# Altium schematic sheet Sheet1.SchDoc
size A
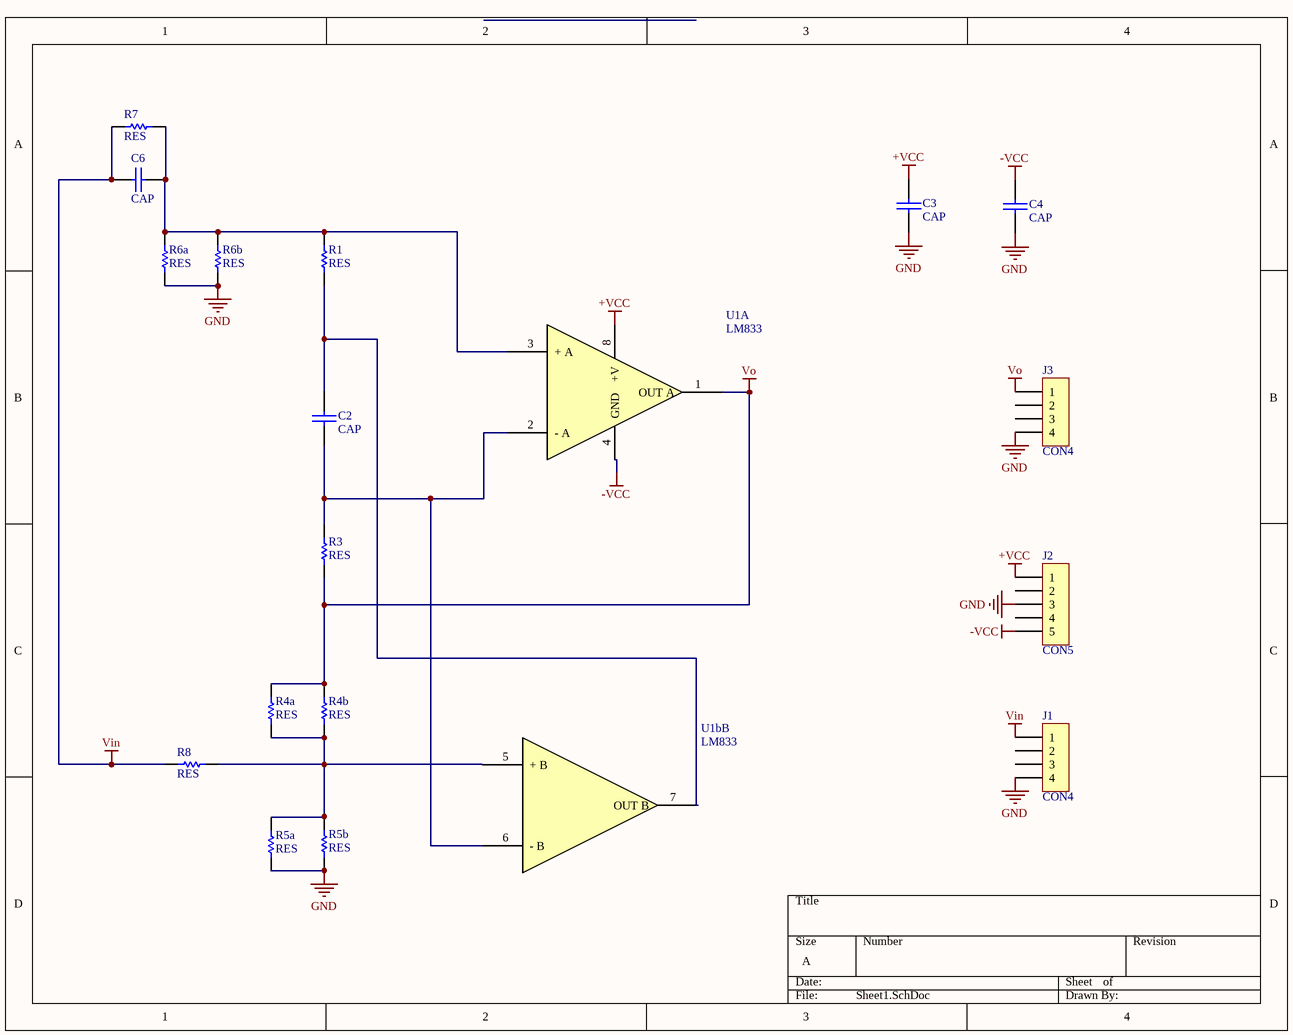
[diagram p0: Sheet1.SchDoc]

## Parts
C2  CAP  [CAP200]
C3  CAP  [CAP200]
C4  CAP  [CAP200]
C6  CAP  [CAP200]
J1  CON4  [SIP4]
J2  CON5  [SIP5]
J3  CON4  [SIP4]
R1  RES  [0805]
R3  RES  [0805]
R4a  RES  [0805]
R4b  RES  [0805]
R5a  RES  [0805]
R5b  RES  [0805]
R6a  RES  [0805]
R6b  RES  [0805]
R7  RES  [0805]
R8  RES  [0805]
U1  LM833  [DIP8]  (part A of 2)
U1b  LM833  [DIP8]  (part B of 2)

## Nets
+VCC: C3.1 J2.1 U1.8(+V)
-VCC: C4.1 J2.5 U1.4(GND)
GND: C3.2 C4.2 J1.4 J2.3 J3.4 R5a.1 R5b.1 R6a.1 R6b.1
Vin: C6.1 J1.1 R7.1 R8.1
Vo: J3.1 R3.1 R4a.2 R4b.2 U1.1(OUT_A)
NetC2_1: C2.1 R1.1 U1b.7(OUT_B)
NetC2_2: C2.2 R3.2 U1.2(-_A) U1b.6(-_B)
NetC6_2: C6.2 R1.2 R6a.2 R6b.2 R7.2 U1.3(+_A)
NetR4a_1: R4a.1 R4b.1 R5a.2 R5b.2 R8.2 U1b.5(+_B)

Not connected (* = marked no-connect by the designer): J1 2 3; J2 2 4; J3 2 3

## Library data of the parts
U1 U1b = LM833: Dual Audio Operational Amplifier